# EasyEDA schematic The_ghostLink_schematic.json
TITLE: Sheet_1; REV: 1.0; Date: 2024-10-11; Sheet: 1/1; Company: Your Company
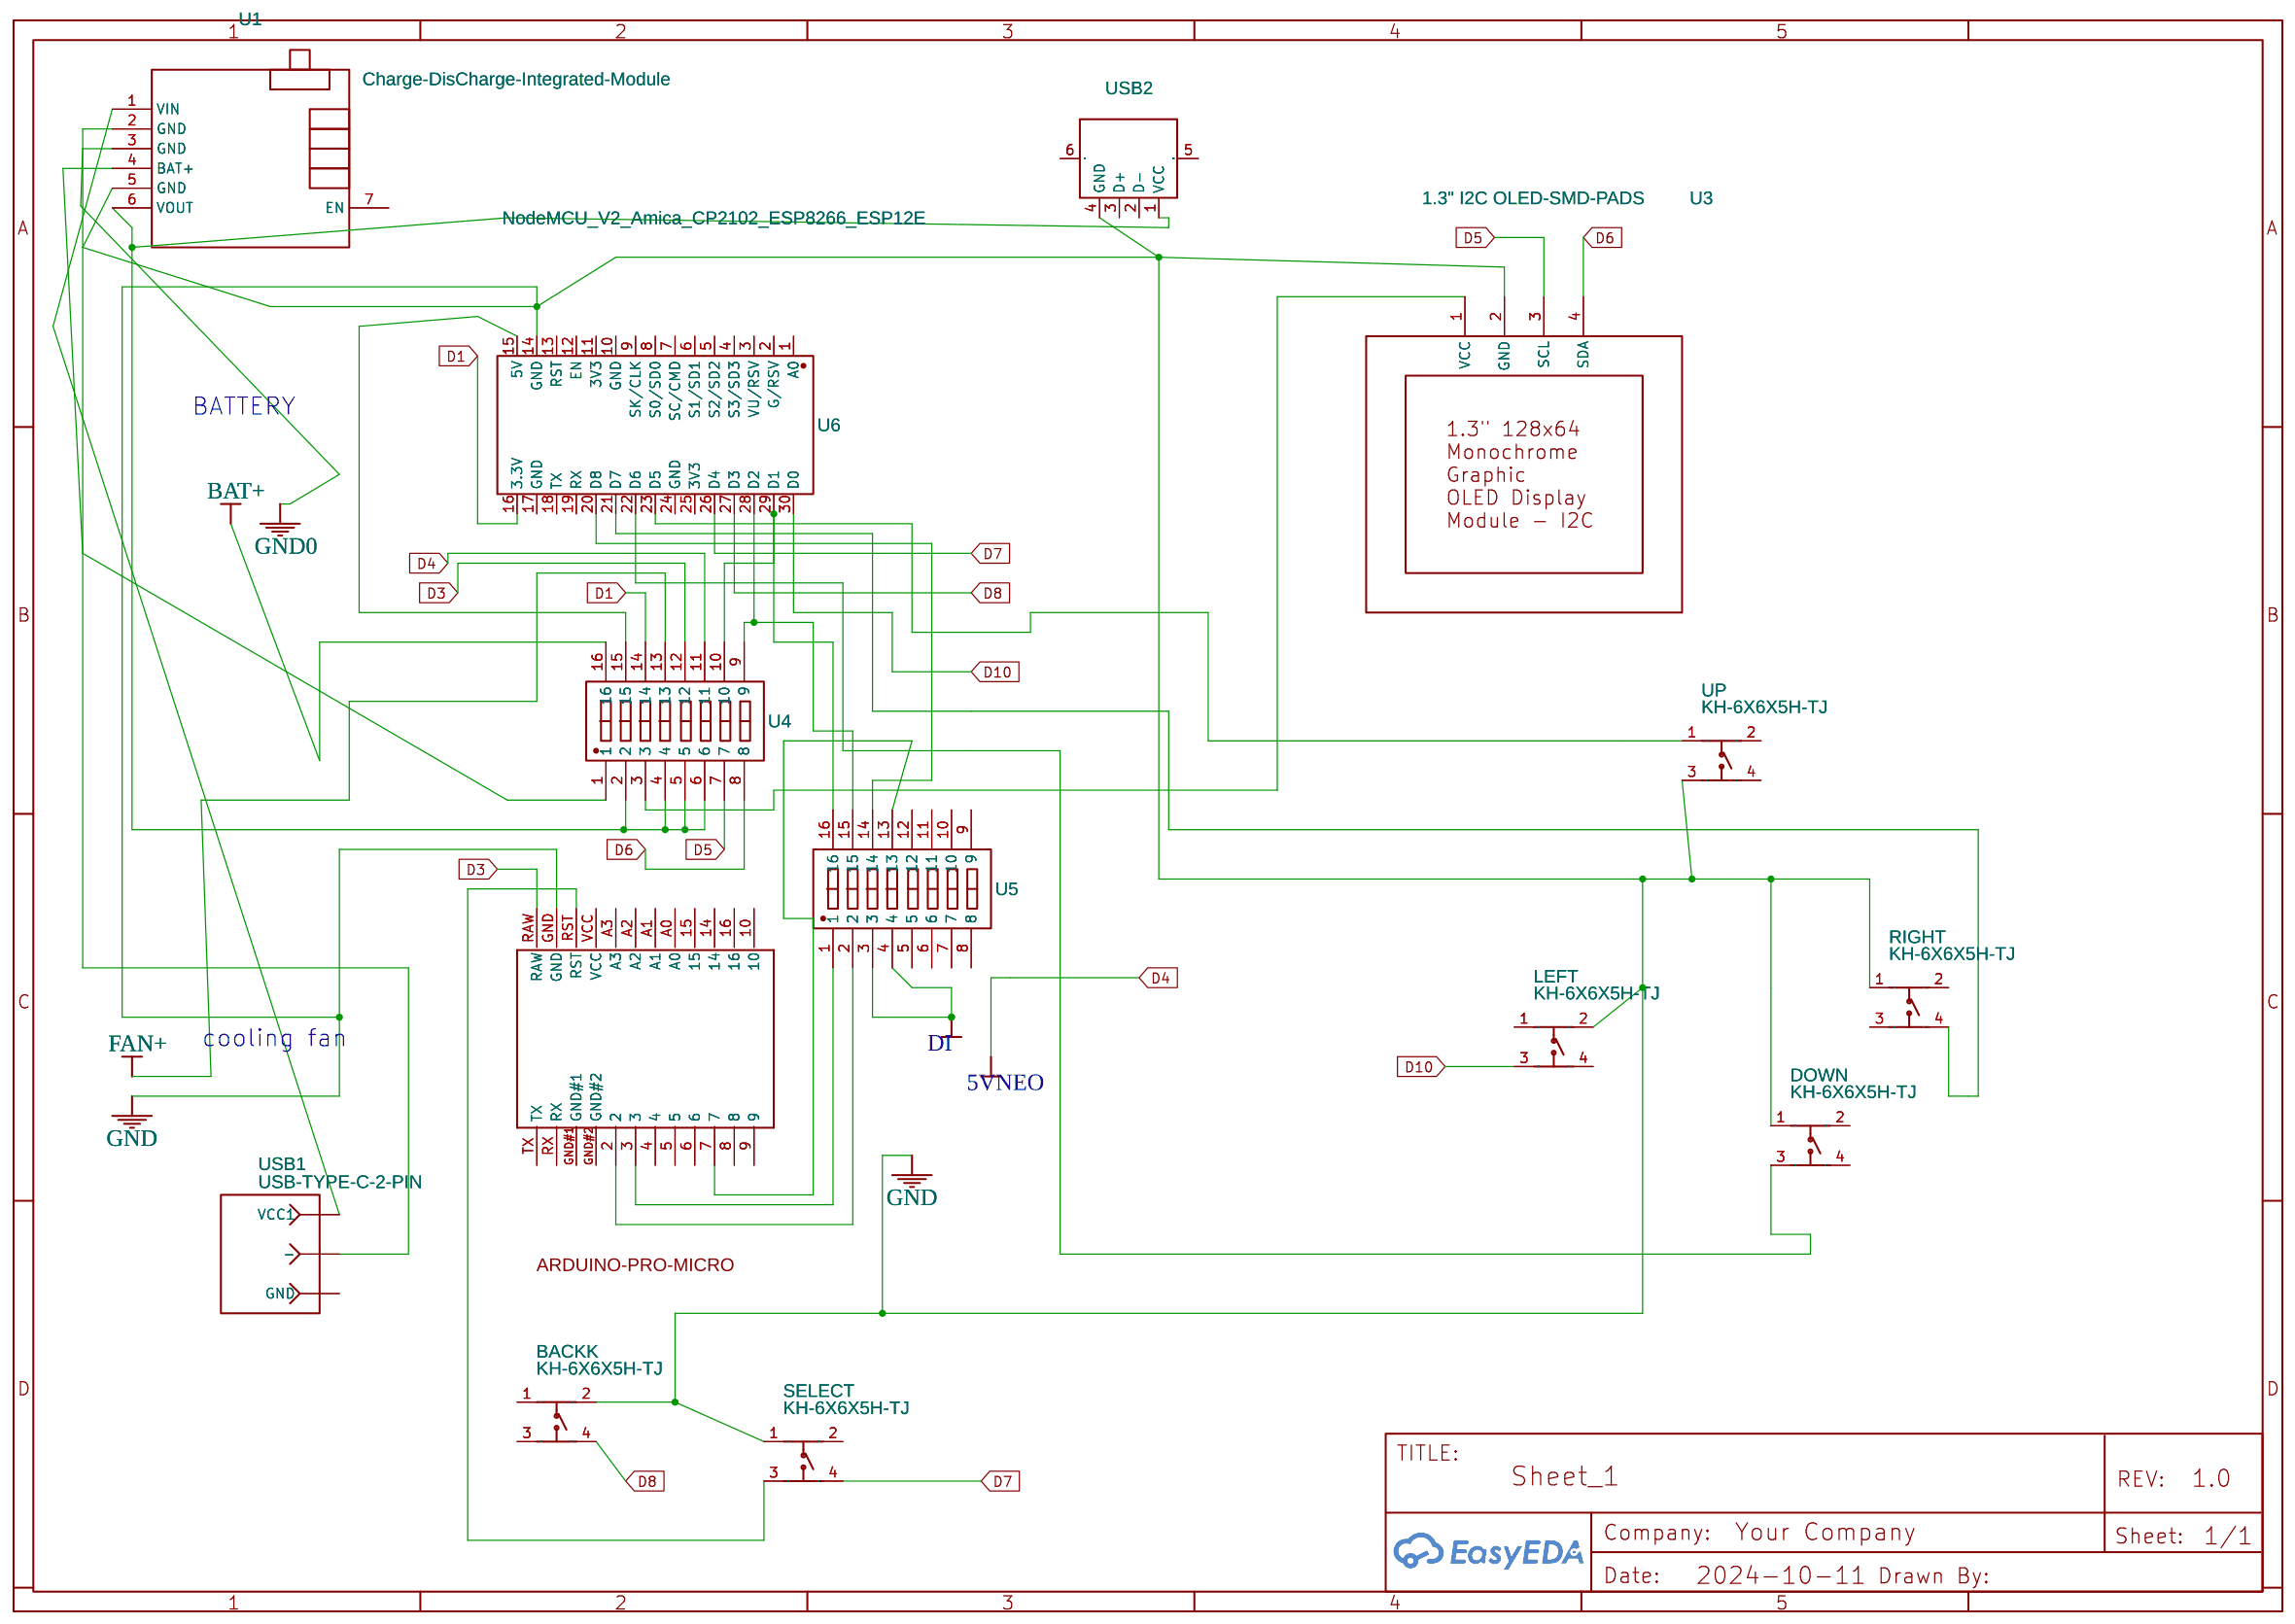
[diagram p0: schematic sheet]

## Parts
BACKK  KH-6X6X5H-TJ  [SW-TH_4P-L6.0-W6.0-P4.50-LS6.5]
DOWN  KH-6X6X5H-TJ  [SW-TH_4P-L6.0-W6.0-P4.50-LS6.5]
LEFT  KH-6X6X5H-TJ  [SW-TH_4P-L6.0-W6.0-P4.50-LS6.5]
RIGHT  KH-6X6X5H-TJ  [SW-TH_4P-L6.0-W6.0-P4.50-LS6.5]
SELECT  KH-6X6X5H-TJ  [SW-TH_4P-L6.0-W6.0-P4.50-LS6.5]
U1  Charge-DisCharge-Integrated-Module  [CHARGE DISCHARGE INTEGRATED MODULE]
U2  ARDUINO PRO MICRO  [ARDUINO-PRO-MICRO]
U3  1.3" I2C OLED-SMD-PADS  [1.3" I2C OLED-SMD-PADS]
U4  SMQS-08R-TP  [SW-TH_16P-L21.7-W9.7-P2.54-BL]
U5  SMQS-08R-TP  [SW-TH_16P-L21.7-W9.7-P2.54-BL]
U6  NodeMCU_V2_Amica_CP2102_ESP8266_ESP12E  [NODEMCU_V2_AMICA_CP2102_ESP8266_ESP12E]
UP  KH-6X6X5H-TJ  [SW-TH_4P-L6.0-W6.0-P4.50-LS6.5]
USB1  USB-TYPE-C-2-PIN  [USB-TYPE-C-2-PIN]
USB2  AF Bend foot Have side Inside the bomb iron PBT White plastic 90degree  [USB-A-TH_JTJ-USB-AF-03]

## Library data of the parts
BACKK DOWN LEFT RIGHT SELECT UP = KH-6X6X5H-TJ: Contributor: LCSC; Supplier: LCSC; Supplier Part: C2837515; Manufacturer: kinghelm(金航标); JLCPCB Part Class: Extended Part
U1 = Charge-DisCharge-Integrated-Module: Contributor: tianyihu
U2 = ARDUINO PRO MICRO: Contributor: westbeach_359; Package Display: Yes
U3 = 1.3" I2C OLED-SMD-PADS: Supplier: DisplayModule; Supplier Part: DM-OLED13-637; link: https://www.displaymodule.com/collections/oled/products/1-3-128x64-monochrome-graphic-oled-display-module-i2c?variant=14178986590306; Contributor: bhosaletejas03
U4 U5 = SMQS-08R-TP: Supplier: LCSC; Supplier Part: C5299509; Manufacturer: SM Switch; JLCPCB Part Class: Extended Part; Contributor: lcsc
U6 = NodeMCU_V2_Amica_CP2102_ESP8266_ESP12E: Contributor: sampr88
USB1 = USB-TYPE-C-2-PIN: Contributor: vikey
USB2 = AF Bend foot Have side Inside the bomb iron PBT White plastic 90degree: Supplier: LCSC; Manufacturer: 精拓金; Manufacturer Part: 901-131A1011D10100; Supplier Part: C39431; JLCPCB Part Class: Extended Part

## Nets
5VNEO: U4.11
GND: BACKK.2 DOWN.1 LEFT.2 RIGHT.1 SELECT.1 U1.5(GND) U2.GND U3.2(GND) U6.14(GND) UP.3 USB2.4(GND)
GND0: U1.3(GND)
BAT+: U4.16
D1: U4.14 U6.16(3.3V)
D3: U2.RAW U4.12
D5: U3.3(SCL) U4.7
D6: U3.4(SDA) U4.8
D7: SELECT.4 U6.26(D4)
D8: BACKK.4 U6.27(D3)
D10: LEFT.3 U6.30(D0)
DI: U5.3 U5.4
FAN+: U4.13
Net-(DOWN-3): DOWN.3 U6.22(D6)
Net-(RIGHT-4): RIGHT.4 U6.21(D7)
Net-(SELECT-3): SELECT.3 U2.RST
Net-(U1-1): U1.1(VIN) USB1.1(VCC1)
Net-(U1-2): U1.2(GND) USB1.2(-)
Net-(U1-4): U1.4(BAT+) U4.1
Net-(U1-6): U1.6(VOUT) U4.2 U4.4 U4.5 U4.6 USB2.1(VCC)
Net-(U2-2): U2.2 U5.2
Net-(U2-3): U2.3 U5.1
Net-(U2-7): U2.7 U5.13
Net-(U3-1): U3.1(VCC) U4.3
Net-(U4-9): U4.9 U5.15 U6.28(D2)
Net-(U4-10): U4.10 U5.16 U6.29(D1)
Net-(U4-15): U4.15 U6.15(5V)
Net-(U5-14): U5.14 U6.20(D8)
Net-(U6-23): U6.23(D5) UP.1

Not connected (* = marked no-connect by the designer): BACKK 1 3; DOWN 2 4; LEFT 1 4; RIGHT 2 3; SELECT 2; U1 7(EN); U2 4 5 6 8 9 10 14 15 16 A0 A1 A2 A3 GND#1 GND#2 RX TX VCC; U5 5 6 7 8 9 10 11 12; U6 1(A0) 2(G/RSV) 3(VU/RSV) 4(S3/SD3) 5(S2/SD2) 6(S1/SD1) 7(SC/CMD) 8(S0/SD0) 9(SK/CLK) 10(GND) 11(3V3) 12(EN) 13(RST) 17(GND) 18(TX) 19(RX) 24(GND) 25(3V3); UP 2 4; USB1 3(GND); USB2 2(D-) 3(D+) 5(SH2) 6(SH1)

## Notes on the sheet
- BATTERY
- cooling fan
